# Altium schematic sheet Main.SchDoc: Main
size A4; Author: Parker Brown
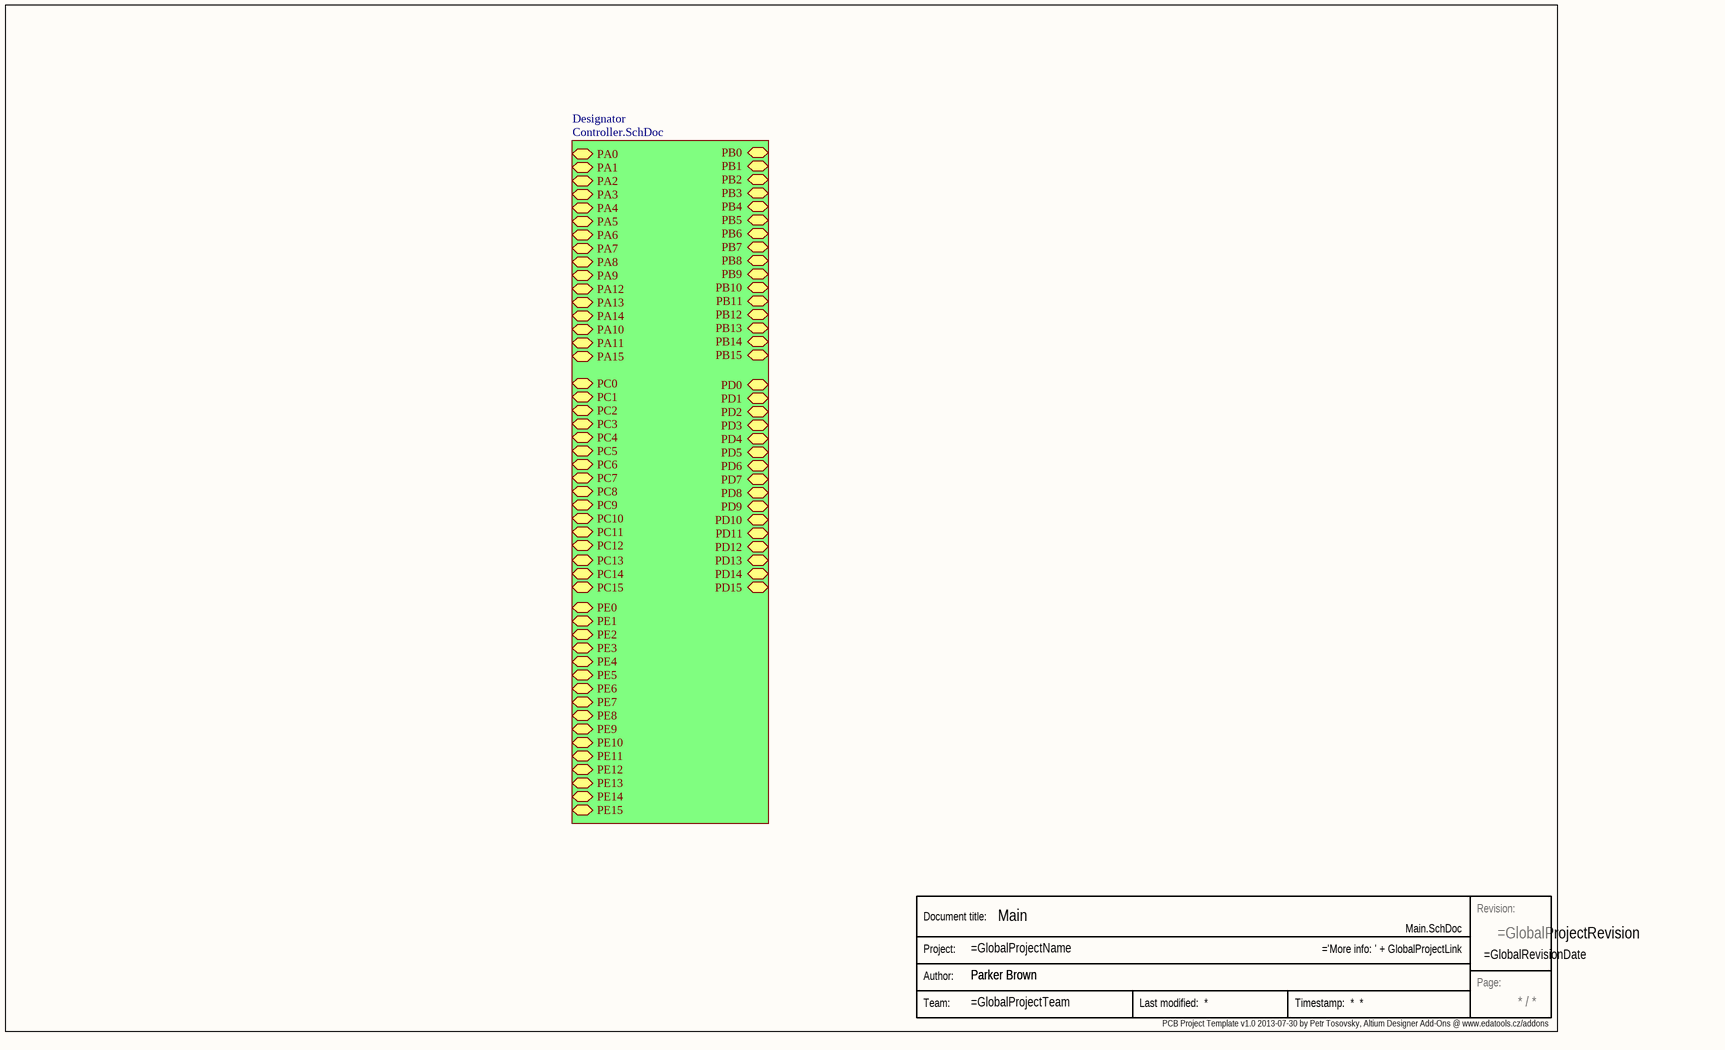
[diagram p0: Main.SchDoc]

## Parts
Stamp  Stamp  (value not drawn)  (graphical)

## Sub-sheets
Designator = Controller.SchDoc: PA0, PA1, PA2, PA3, PA4, PA5, PA6, PA7, PA8, PA9, PA12, PA13, PA14, PA10, PA11, PA15, PC0, PC1, PC2, PC3, PC4, PC5, PC6, PC7, PC8, PC9, PC13, PC14, PC15, PC11, PC12, PC10, PE0, PE1, PE2, PE3, PE4, PE5, PE6, PE7, PE8, PE9, PE10, PE11, PE12, PE13, PE14, PE15, PB0, PB1, PB2, PB3, PB4, PB5, PB6, PB7, PB8, PB9, PB10, PB11, PB12, PB13, PB14, PB15, PD0, PD1, PD2, PD3, PD4, PD5, PD6, PD7, PD8, PD9, PD10, PD11, PD12, PD13, PD14, PD15

## Notes on the sheet
- PCB Project Template v1.0 2013-07-30 by Petr Tosovsky, Altium Designer Add-Ons @ www.edatools.cz/addons <http://www.edatools.cz/addons>
- (in symbol Stamp) Revision:; Document title:; Project:; Author:; Page:; Team: